# Altium schematic sheet ffccon.SchDoc
size 297 x 209 mm
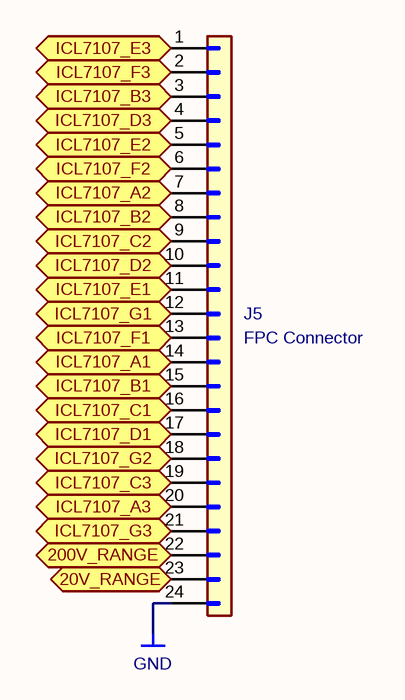
[diagram p0: ffccon.SchDoc]

## Parts
#PWR26  GND
J5  FPC Connector  [FPC_24]

## Ports
20V_RANGE (bidir), 200V_RANGE (bidir), ICL7107_A1 (bidir), ICL7107_A2 (bidir), ICL7107_A3 (bidir), ICL7107_B1 (bidir), ICL7107_B2 (bidir), ICL7107_B3 (bidir), ICL7107_C1 (bidir), ICL7107_C2 (bidir), ICL7107_C3 (bidir), ICL7107_D1 (bidir), ICL7107_D2 (bidir), ICL7107_D3 (bidir), ICL7107_E1 (bidir), ICL7107_E2 (bidir), ICL7107_E3 (bidir), ICL7107_F1 (bidir), ICL7107_F2 (bidir), ICL7107_F3 (bidir), ICL7107_G1 (bidir), ICL7107_G2 (bidir), ICL7107_G3 (bidir)

## Nets
20V_RANGE: J5.23(Pin_23) ; port 20V_RANGE
200V_RANGE: J5.22(Pin_22) ; port 200V_RANGE
ICL7107_A1: J5.14(Pin_14) ; port ICL7107_A1
ICL7107_A2: J5.7(Pin_7) ; port ICL7107_A2
ICL7107_A3: J5.20(Pin_20) ; port ICL7107_A3
ICL7107_B1: J5.15(Pin_15) ; port ICL7107_B1
ICL7107_B2: J5.8(Pin_8) ; port ICL7107_B2
ICL7107_B3: J5.3(Pin_3) ; port ICL7107_B3
ICL7107_C1: J5.16(Pin_16) ; port ICL7107_C1
ICL7107_C2: J5.9(Pin_9) ; port ICL7107_C2
ICL7107_C3: J5.19(Pin_19) ; port ICL7107_C3
ICL7107_D1: J5.17(Pin_17) ; port ICL7107_D1
ICL7107_D2: J5.10(Pin_10) ; port ICL7107_D2
ICL7107_D3: J5.4(Pin_4) ; port ICL7107_D3
ICL7107_E1: J5.11(Pin_11) ; port ICL7107_E1
ICL7107_E2: J5.5(Pin_5) ; port ICL7107_E2
ICL7107_E3: J5.1(Pin_1) ; port ICL7107_E3
ICL7107_F1: J5.13(Pin_13) ; port ICL7107_F1
ICL7107_F2: J5.6(Pin_6) ; port ICL7107_F2
ICL7107_F3: J5.2(Pin_2) ; port ICL7107_F3
ICL7107_G1: J5.12(Pin_12) ; port ICL7107_G1
ICL7107_G2: J5.18(Pin_18) ; port ICL7107_G2
ICL7107_G3: J5.21(Pin_21) ; port ICL7107_G3

Not connected (* = marked no-connect by the designer): #PWR26 1(GND); J5 24(Pin_24)

## Notes on the sheet
- 1
- 2
- 3
- 4
- 5
- 6
- A
- B
- C
- Konektor FFC trake za povezivanje LCD-a
- D
- Title: Uređaj za merenje efektivne vrednosti AC napona
- File: ffccon.kicad_sch
- Sheet: /
- Srđan Milkić
- KiCad E.D.A.  kicad (5.1.4)-1
- Size: A4
- Date: 2024-01-19
- Rev: 2
- Id: 1/1

## Library data of the parts
J5 = Conn_01x24: Value: FPC Connector; Footprint: priums_lib:FPC_24
#PWR26 = GND: Value: GND